# EAGLE design 4ChannelSlidePotBoard (EAGLE 7.2.0)
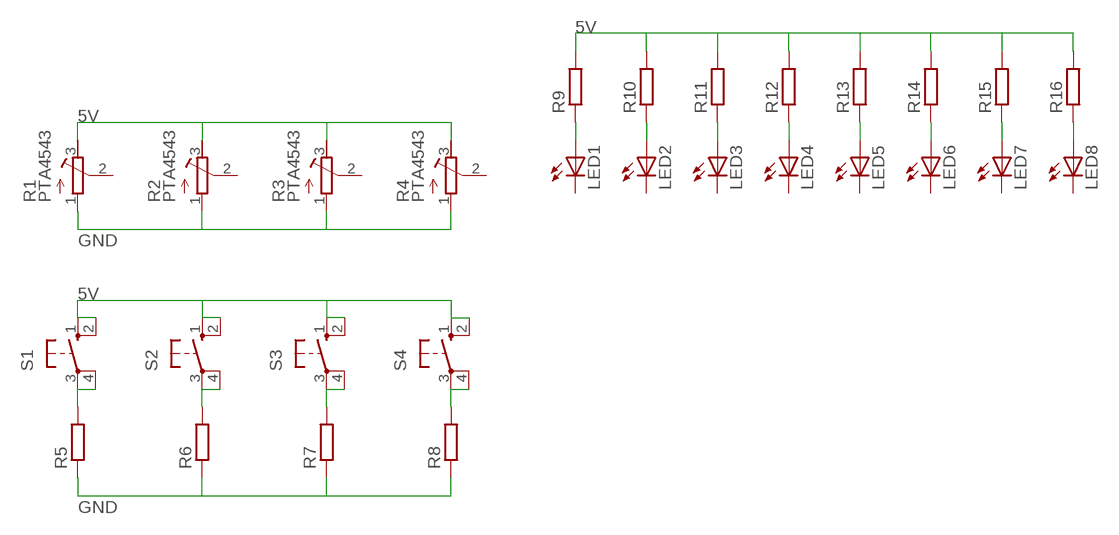
[diagram p0: schematic, sheet 1]

## Parts
LED1  LED3MM  [LED3MM]
LED2  LED3MM  [LED3MM]
LED3  LED3MM  [LED3MM]
LED4  LED3MM  [LED3MM]
LED5  LED3MM  [LED3MM]
LED6  LED3MM  [LED3MM]
LED7  LED3MM  [LED3MM]
LED8  LED3MM  [LED3MM]
R1  PTA4543  [4543]
R2  PTA4543  [4543]
R3  PTA4543  [4543]
R4  PTA4543  [4543]
R5  R-EU_R1206  [R1206]
R6  R-EU_R1206  [R1206]
R7  R-EU_R1206  [R1206]
R8  R-EU_R1206  [R1206]
R9  R-EU_R1206  [R1206]
R10  R-EU_R1206  [R1206]
R11  R-EU_R1206  [R1206]
R12  R-EU_R1206  [R1206]
R13  R-EU_R1206  [R1206]
R14  R-EU_R1206  [R1206]
R15  R-EU_R1206  [R1206]
R16  R-EU_R1206  [R1206]
S1  40-XX  [B3F-40XX]
S2  40-XX  [B3F-40XX]
S3  40-XX  [B3F-40XX]
S4  40-XX  [B3F-40XX]

## Nets
5V: R1.3 R2.3 R3.3 R4.3 R9.2 R10.2 R11.2 R12.2 R13.2 R14.2 R15.2 R16.2 S1.1(S) S1.2(S1) S2.1(S) S2.2(S1) S3.1(S) S3.2(S1) S4.1(S) S4.2(S1)
GND: R1.1 R2.1 R3.1 R4.1 R5.1 R6.1 R7.1 R8.1
N$1: R5.2 S1.3(P) S1.4(P1)
N$2: R6.2 S2.3(P) S2.4(P1)
N$3: R7.2 S3.3(P) S3.4(P1)
N$4: R8.2 S4.3(P) S4.4(P1)
N$5: LED1.A R9.1
N$6: LED2.A R10.1
N$7: LED3.A R11.1
N$8: LED4.A R12.1
N$9: LED5.A R13.1
N$10: LED6.A R14.1
N$11: LED7.A R15.1
N$12: LED8.A R16.1
Unconnected: LED1.K(C) LED2.K(C) LED3.K(C) LED4.K(C) LED5.K(C) LED6.K(C) LED7.K(C) LED8.K(C) R1.2 R2.2 R3.2 R4.2

## Library data of the parts
LED1-LED8 = led:LED: LED OSRAM: - CHIPLED LG R971, LG N971, LY N971, LG Q971, LY Q971, LO R971, LY R971 LH N974, LH R974 LS Q976, LO Q976, LY Q976 LO Q996 - Hyper CHIPLED LW Q18S LB Q993, LB Q99A, LB R99A - SideLED LS A670, LO A670, LY A670, LG A670, LP A670 LB A673, LV A673, LT A673, LW A673 LH A674 LY A675 LS A676, LA A676, LO A676, LY A676, LW A676 LS A679, LY A679, LG A679 - Hyper Micro SIDELED® LS Y876, LA Y876, LO Y876, LY Y876 LT Y87S - SmartLED LW L88C, LW L88S LB L89C, LB L89S, LG L890 LS L89K, LO L89K, LY L89K LS L896, LA L896, LO L896, LY L896 - TOPLED LS T670, LO T670, LY T670, LG T670, LP T670 LSG T670, LSP T670, LSY T670, LOP T670, LYG T670 LG T671, LOG T671, LSG T671 LB T673, LV T673, LT T673, LW T673 LH T674 LS T676, LA T676, LO T676, LY T676, LB T676, LH T676, LSB T676, LW T676 LB T67C, LV T67C, LT T67C, LS T67K, LO T67K, LY T67K, LW E67C LS E67B, LA E67B, LO E67B, LY E67B, LB E67C, LV E67C, LT E67C LW T67C LS T679, LY T679, LG T679 LS T770, LO T770, LY T770, LG T770, LP T770 LB T773, LV T773, LT T773, LW T773 LH T774 LS E675, LA E675, LY E675, LS T675 LS T776, LA T776, LO T776, LY T776, LB T776 LHGB T686 LT T68C, LB T68C - Hyper Mini TOPLED® LB M676 - Mini TOPLED Santana® LG M470 LS M47K, LO M47K, LY M47K Source: http://www.osram.convergy.de LUXEON: - LUMILED® LXK2-PW12-R00, LXK2-PW12-S00, LXK2-PW14-U00, LXK2-PW14-V00 LXK2-PM12-R00, LXK2-PM12-S00, LXK2-PM14-U00 LXK2-PE12-Q00, LXK2-PE12-R00, LXK2-PE12-S00, LXK2-PE14-T00, LXK2-PE14-U00 LXK2-PB12-K00, LXK2-PB12-L00, LXK2-PB12-M00, LXK2-PB14-N00, LXK2-PB14-P00, LXK2-PB14-Q00 LXK2-PR12-L00, LXK2-PR12-M00, LXK2-PR14-Q00, LXK2-PR14-R00 LXK2-PD12-Q00, LXK2-PD12-R00, LXK2-PD12-S00 LXK2-PH12-R00, LXK2-PH12-S00 LXK2-PL12-P00, LXK2-PL12-Q00, LXK2-PL12-R00 Source: www.luxeon.com KINGBRIGHT: KA-3528ASYC Source: www.kingbright.com
R1-R4 = BOURNS_PTASeries_slidepot:PTA4543: PTA4543 BOURNS Slide Potentiometer 1 Gang 45mm (1.17in) slider travel
R5-R16 = resistor:R-EU_: RESISTOR, European symbol
S1-S4 = switch-omron:40-XX: OMRON SWITCH; MF: OMRON COMPONENTS USA; MPN: B3F-4000; OC_FARNELL: 176434; OC_NEWARK: 36K3105

## Board
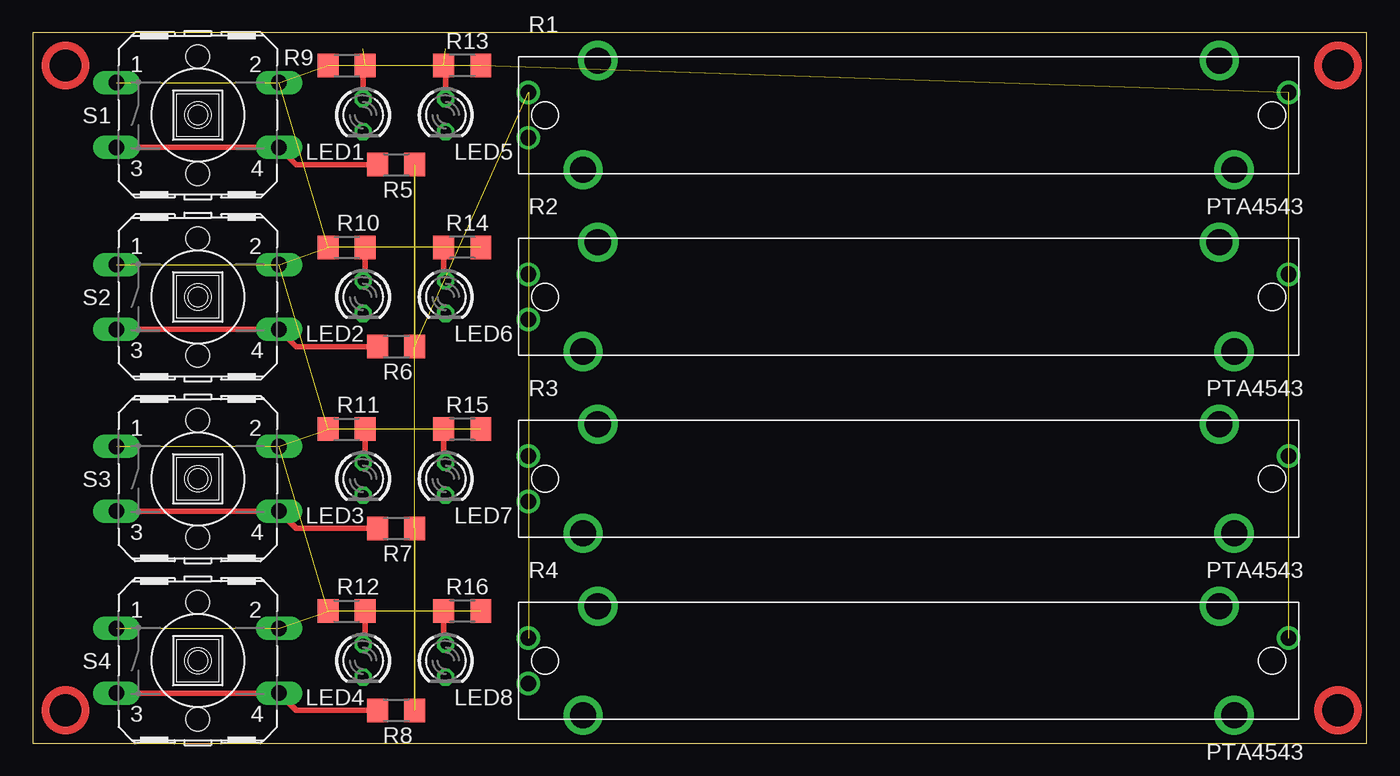
[diagram p1: board, top side]

Size 102.54 x 54.6 mm. Coordinates in mm from the lower left corner, seen from the top.
Outline: 0,0 102.54,0 102.54,54.6 0,54.6 0,0
Copper layers (1*16): Top 0.035mm / dielectric 1.5mm / Bottom 0.035mm
Design rules "default": minimum track width 10mil, minimum drill 24mil, track to track 8mil, track to pad 8mil, pad to pad 8mil, via to via 8mil, smd to smd 8mil, copper to edge 40mil, drill to drill 8mil, minimum pad ring 10mil, minimum via ring 8mil, stop-mask expansion 4mil, vias tented up to drill 0mil, thermal gap 10mil

### Footprints (pad centres in the part's own frame; a part is rotated, then mirrored left to right if it is on the bottom)
LED3MM = drill 0.813 octagon: A -1.27,0; K 1.27,0
4543 = drill 1.2: 1 -29.21,1.74; 2 -29.21,-1.74; 3 29.21,1.74 | drill 2: P$4 -23.876,4.191; P$5 23.876,4.191; P$6 25.019,-4.191; P$7 -25.019,-4.191
R1206 = smd 1.6 x 1.803: 1 -1.422,0; 2 1.422,0
B3F-40XX = drill 1.194 long: 1 -6.248,2.489; 2 6.248,2.489; 3 -6.248,-2.489; 4 6.248,-2.489 | hole 1.803: 0,-4.496; 0,4.496

### Placement (x,y rotation side)
LED1  25.4,48.26 270 top
LED2  25.4,34.29 270 top
LED3  25.4,20.32 270 top
LED4  25.4,6.35 270 top
LED5  31.75,48.26 270 top
LED6  31.75,34.29 270 top
LED7  31.75,20.32 270 top
LED8  31.75,6.35 270 top
R1  67.31,48.26 0 top
R2  67.31,34.29 0 top
R3  67.31,20.32 0 top
R4  67.31,6.35 0 top
R5  27.94,44.45 180 top
R6  27.94,30.48 180 top
R7  27.94,16.51 180 top
R8  27.94,2.54 180 top
R9  24.13,52.07 180 top
R10  24.13,38.1 180 top
R11  24.13,24.13 180 top
R12  24.13,10.16 180 top
R13  33.02,52.07 0 top
R14  33.02,38.1 0 top
R15  33.02,24.13 0 top
R16  33.02,10.16 0 top
S1  12.7,48.26 0 top
S2  12.7,34.29 0 top
S3  12.7,20.32 0 top
S4  12.7,6.35 0 top

### Tracks (layer width: path | path; a pad name or v marks a point on that pad's centre or on a via)
5V  (19 unrouted)
GND  (7 unrouted)
N$1
  Top 0.406: S1.3 S1.4 | S1.4 19,45.77 19.05,45.72 | R5.2 20.27,44.45 S1.4
N$2
  Top 0.406: S2.3 17.73,31.8 17.78,31.75 18.9,31.75 S2.4 20.27,30.48 R6.2
N$3
  Top 0.406: S3.3 S3.4 | S3.4 20.27,17.83 20.32,17.78 | R7.2 20.27,16.51 S3.4
N$4
  Top 0.406: S4.3 S4.4 20.27,2.54 R8.2
N$5  (1 unrouted)
  Top 0.406: LED1.A 25.4,51.92 R9.1
N$6
  Top 0.406: LED2.A 25.55,35.71 R10.1
N$7
  Top 0.406: LED3.A 25.55,21.74 R11.1
N$8
  Top 0.406: LED4.A 25.55,7.77 R12.1
N$9  (1 unrouted)
  Top 0.406: LED5.A 31.75,51.92 R13.1
N$10
  Top 0.406: LED6.A 31.6,35.71 R14.1
N$11
  Top 0.406: LED7.A 31.6,21.74 R15.1
N$12
  Top 0.406: LED8.A 31.6,7.77 R16.1
(copper drawn outside any net)
  shapes: Top circle x4